# EAGLE design CircuitDiagram (EAGLE 9.3.0)
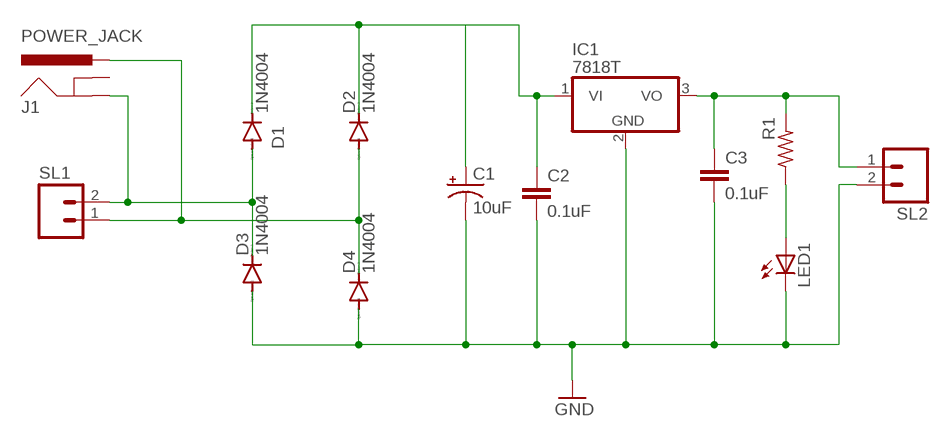
[diagram p0: schematic, sheet 1]

## Parts
C1  10uF  10UF-POLAR-RADIAL-2.5MM-KIT-25V-20%  [CPOL-RADIAL-2.5MM-5MM-KIT]
C2  0.1uF  0.1UF-KIT-EZ-50V-20%  [CAP-PTH-SMALL-KIT]
C3  0.1uF  0.1UF-KIT-EZ-50V-20%  [CAP-PTH-SMALL-KIT]
D1  1N4004  [DO41-10]
D2  1N4004  [DO41-10]
D3  1N4004  [DO41-10]
D4  1N4004  [DO41-10]
IC1  7818T  [TO220H]
J1  POWER_JACK  [POWER_JACK_PTH]
LED1  LED3MM  [LED3MM]
R1  R-US_0207/9  [0207/9]
SL1  M02  [02P]
SL2  M02  [02P]

## Nets
GND: C1.2(-) C2.2 C3.2 D3.A D4.A IC1.2(GND) LED1.K(C) SL2.2
N$1: C1.1(+) C2.1 D1.C D2.C IC1.1(VI)
N$2: C3.1 IC1.3(VO) R1.2 SL2.1
N$3: D1.A D3.C J1.GND SL1.2
N$4: D2.A D4.C J1.PWR SL1.1
N$8: LED1.A R1.1
Unconnected: J1.GNDBREAK

## Library data of the parts
C1 = SparkFun-Capacitors:10UF-POLAR: 10.0µF polarized capacitors A capacitor is a passive two-terminal electrical component used to store electrical energy temporarily in an electric field.; PROD_ID: CAP-08440
C2 C3 = SparkFun-Capacitors:0.1UF: 0.1µF ceramic capacitors A capacitor is a passive two-terminal electrical component used to store electrical energy temporarily in an electric field.; PROD_ID: CAP-08370
D1-D4 = diode:1N4004: DIODE general purpose rectifier, 1 A
IC1 = linear:78*: Positive VOLTAGE REGULATOR Source: http://cache.national.com/ds/LM/LM78L05.pdf http://www.fairchildsemi.com/ds/LM/LM7805.pdf
J1 = SparkFun-Connectors:POWER_JACK: Power Jack Connector This is the standard 5.5mm barrel jack for power. The PTH is the most common, proven, reliable, footprint. The Slot footprint only works if the mill layer is transmitted to the PCB fab house so be warned. Here are the connectors we sell at SparkFun: DC Barrel Power Jack/Connector <https://www.sparkfun.com/products/119> (PRT-00119) DC Barrel Power Jack/Connector (SMD) <https://www.sparkfun.com/products/12748> (PRT-12748) DC Barrel Jack Adapter - Breadboard Compatible <https://www.sparkfun.com/products/10811> (PRT-10811) It is used on this SparkFun product (and many, many others): SparkFun RedBoard - Programmed with Arduino <https://www.sparkfun.com/products/12757> (DEV-12757) Also, if you need a mating power supply or connector, please check these out: Wall Adapter Power Supply - 9VDC 650mA <https://www.sparkfun.com/products/298> (TOL-00298) DC Barrel Jack Adapter - Male <https://www.sparkfun.com/products/10287> (PRT-10287); PROD_ID: CONN-08197
LED1 = adafruit:LED: LED OSRAM: - CHIPLED LG R971, LG N971, LY N971, LG Q971, LY Q971, LO R971, LY R971 LH N974, LH R974 LS Q976, LO Q976, LY Q976 LO Q996 - Hyper CHIPLED LW Q18S LB Q993, LB Q99A, LB R99A - SideLED LS A670, LO A670, LY A670, LG A670, LP A670 LB A673, LV A673, LT A673, LW A673 LH A674 LY A675 LS A676, LA A676, LO A676, LY A676, LW A676 LS A679, LY A679, LG A679 - Hyper Micro SIDELED® LS Y876, LA Y876, LO Y876, LY Y876 LT Y87S - SmartLED LW L88C, LW L88S LB L89C, LB L89S, LG L890 LS L89K, LO L89K, LY L89K LS L896, LA L896, LO L896, LY L896 - TOPLED LS T670, LO T670, LY T670, LG T670, LP T670 LSG T670, LSP T670, LSY T670, LOP T670, LYG T670 LG T671, LOG T671, LSG T671 LB T673, LV T673, LT T673, LW T673 LH T674 LS T676, LA T676, LO T676, LY T676, LB T676, LH T676, LSB T676, LW T676 LB T67C, LV T67C, LT T67C, LS T67K, LO T67K, LY T67K, LW E67C LS E67B, LA E67B, LO E67B, LY E67B, LB E67C, LV E67C, LT E67C LW T67C LS T679, LY T679, LG T679 LS T770, LO T770, LY T770, LG T770, LP T770 LB T773, LV T773, LT T773, LW T773 LH T774 LS E675, LA E675, LY E675, LS T675 LS T776, LA T776, LO T776, LY T776, LB T776 LHGB T686 LT T68C, LB T68C - Hyper Mini TOPLED® LB M676 - Mini TOPLED Santana® LG M470 LS M47K, LO M47K, LY M47K Source: http://www.osram.convergy.de/
R1 = adafruit:R-US_: RESISTOR, American symbol
SL1 SL2 = con-amp-quick:M02: AMP QUICK CONNECTOR; OC_FARNELL: unknown; OC_NEWARK: unknown

## Board
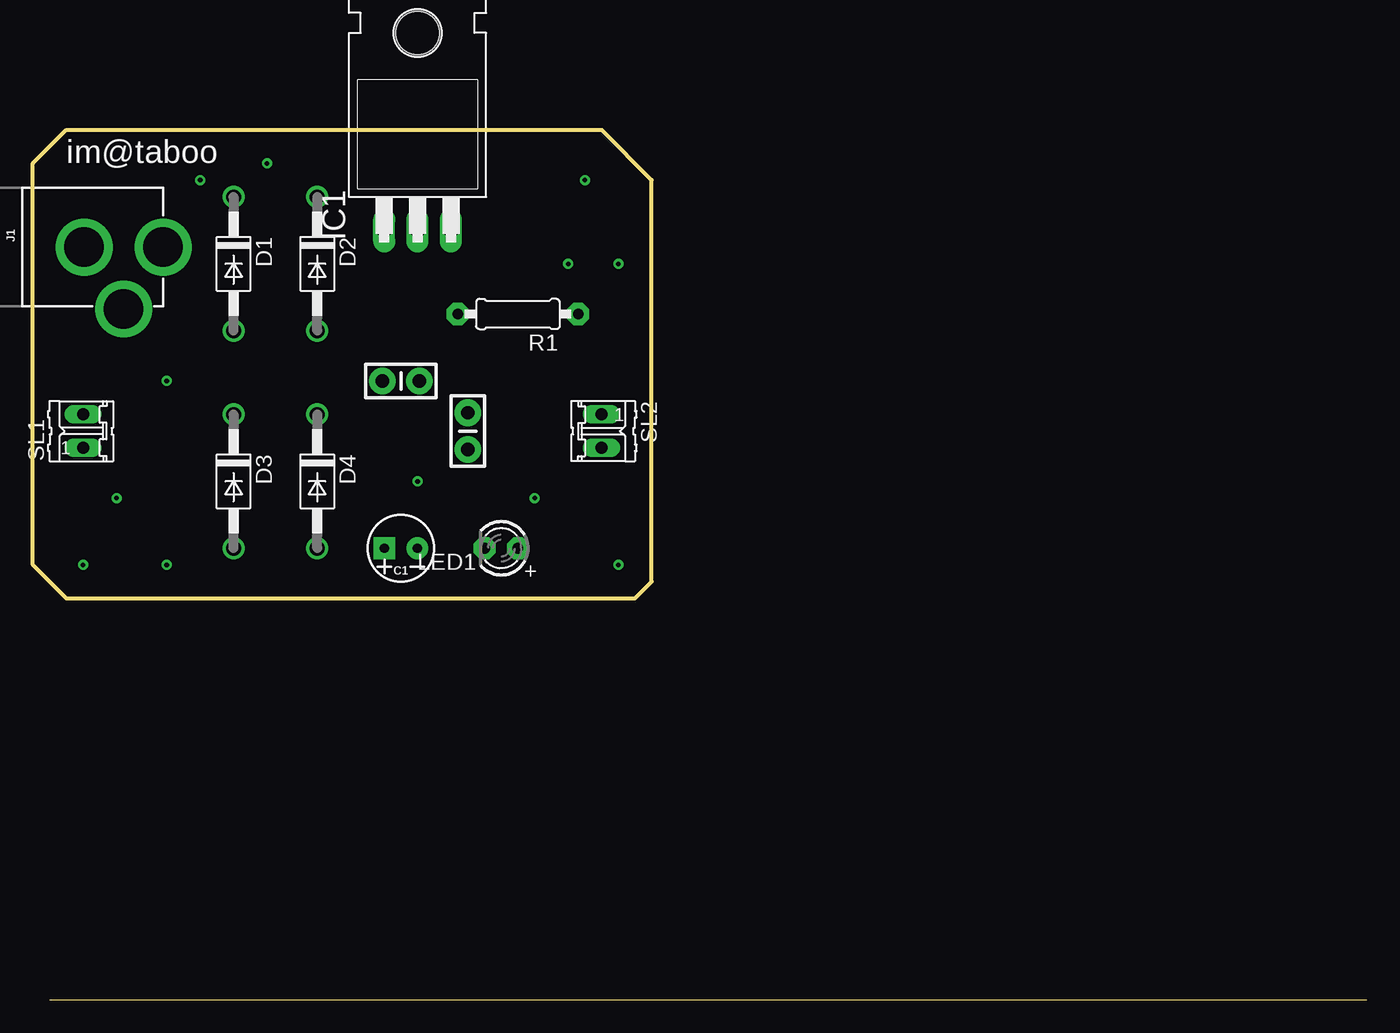
[diagram p1: board, top side]
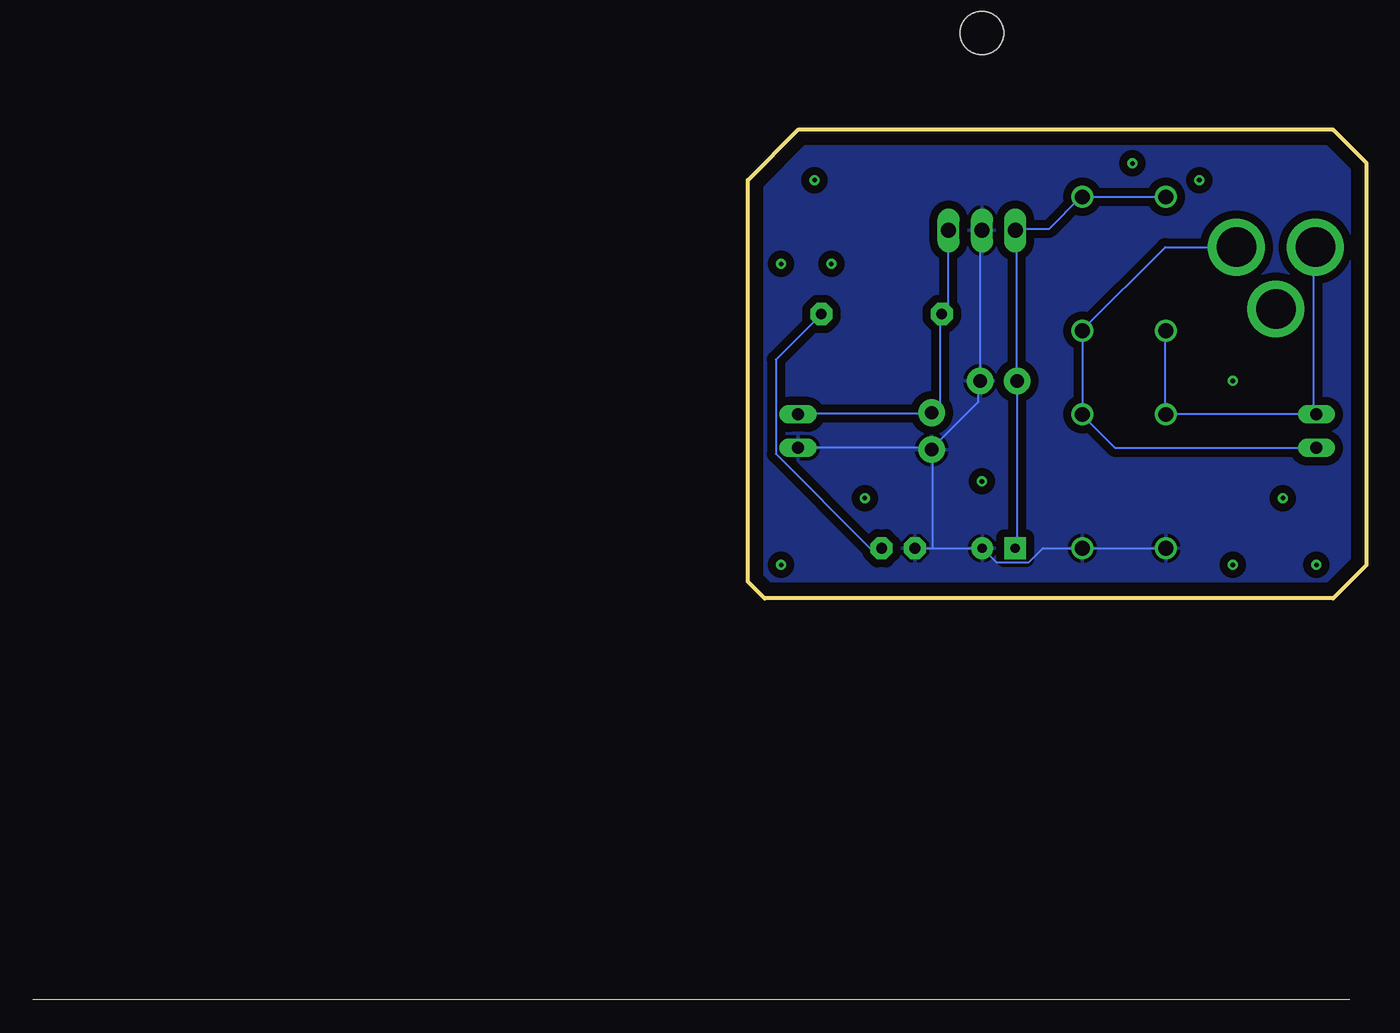
[diagram p2: board, bottom side, seen from below]

Size 101.27 x 66.04 mm. Coordinates in mm from the lower left corner, seen from the top.
Outline: 1.27,0 101.27,0
Outline: 0,33.02 2.54,30.48 45.72,30.48 46.99,31.75 46.99,62.23 43.18,66.04 2.54,66.04 0,63.5 0,33.02
Copper layers (1*16): Top 0.035mm / dielectric 1.5mm / Bottom 0.035mm
Design rules "default": minimum track width 6mil, minimum drill 0.35mm, track to track 6mil, track to pad 6mil, pad to pad 6mil, via to via 6mil, smd to smd 6mil, copper to edge 40mil, drill to drill 6mil, minimum pad ring 10mil, minimum via ring 8mil, stop-mask expansion 4mil, vias tented up to drill 0mil, thermal gap 10mil

### Footprints (pad centres in the part's own frame; a part is rotated, then mirrored left to right if it is on the bottom)
CPOL-RADIAL-2.5MM-5MM-KIT = drill 0.7 pad 1.651 square: 1 1.25,0 | drill 0.7 pad 1.651: 2 -1.25,0
CAP-PTH-SMALL-KIT = drill 1.016 pad 2.032: 1 -1.397,0; 2 1.397,0
DO41-10 = drill 1.118: A 5.08,0; C -5.08,0
TO220H = drill 1.118 long: 1 -2.54,-10.16; 2 0,-10.16; 3 2.54,-10.16 | hole 3.302: 0,4.826
POWER_JACK_PTH = drill 2.997 pad 4.318: GND 0,7.7; GNDBREAK 4.7,10.7; PWR 0,13.7
LED3MM = drill 0.813 pad 1.676 octagon: A -1.27,0; K 1.27,0
0207/9 = drill 0.813 pad 1.676 octagon: 1 -4.572,0; 2 4.572,0
02P = drill 0.914 long: 1 -1.27,0; 2 1.27,0

### Placement (x,y rotation side)
C1  27.94,34.29 180 top
C2  27.94,46.99 0 top
C3  33.02,43.18 270 top
D1  15.24,55.88 270 top
D2  21.59,55.88 270 top
D3  15.24,39.37 270 top
D4  21.59,39.37 270 top
IC1  29.21,68.58 0 top
J1  -3.81,57.15 270 top
LED1  35.56,34.29 180 top
R1  36.83,52.07 180 top
SL1  3.81,43.18 90 top
SL2  43.18,43.18 270 top

### Tracks (layer width: path | path; a pad name or v marks a point on that pad's centre or on a via)
GND
  Bottom 0.152: IC1.2 29.31,58.37 29.31,47.09 C2.2 29.46,46.94 29.46,45.41 32.97,41.91 C3.2 | D3.A D4.A 24.59,34.29 25.65,33.22 28.09,33.22 29.16,34.29 C1.2 32.97,34.29 | LED1.K 32.97,34.29 | SL2.2 33.12,41.91 C3.2 | 32.97,34.29 32.97,41.76 C3.2
  pour Bottom (isolate 0.61): 2.54,66.04 0,63.5 0,33.02 2.54,30.48 45.72,30.48 46.99,31.75 46.99,62.23 43.18,66.04
N$1
  Bottom 0.152: D1.C D2.C 21.69,60.96 24.13,58.52 26.57,58.52 IC1.1 26.57,58.37 26.57,47.09 C2.1 26.57,46.94 26.57,34.29 C1.1
N$2
  Bottom 0.152: IC1.3 31.75,52.58 R1.2 32.36,51.97 32.36,45.26 32.97,44.65 C3.1 33.12,44.5 43.18,44.5 SL2.1
N$3
  Bottom 0.152: 4.01,44.5 15.14,44.5 D3.C 15.29,44.5 15.29,50.75 D1.A | 4.01,44.5 3.86,44.5 SL1.2 4.01,44.5 | 4.01,44.5 4.01,57.15 J1.GND
N$4
  Bottom 0.152: SL1.1 19.1,41.91 21.54,44.35 D4.C 21.54,44.5 21.54,50.75 D2.A 21.54,50.9 15.29,57.15 J1.PWR
N$5  (via drill 0.35)
  other vias: 41.91,62.23
N$6  (via drill 0.35)
  other vias: 44.45,33.02
N$7  (via drill 0.35)
  other vias: 3.81,33.02
N$8
  Bottom 0.152: LED1.A 37.69,34.29 44.86,41.45 44.86,48.62 R1.1
N$9  (via drill 0.35)
  other vias: 6.35,38.1
N$10  (via drill 0.35)
  other vias: 10.16,46.99
N$11  (via drill 0.35)
  other vias: 29.21,39.37
N$12  (via drill 0.35)
  other vias: 10.16,33.02
N$13  (via drill 0.35)
  other vias: 38.1,38.1
N$14  (via drill 0.35)
  other vias: 40.64,55.88
N$15  (via drill 0.35)
  other vias: 44.45,55.88
N$16  (via drill 0.35)
  other vias: 17.78,63.5
N$17  (via drill 0.35)
  other vias: 12.7,62.23

### Text on the board
tPlace: im@taboo